# Altium schematic sheet MCU_LCD.SchDoc
size A4
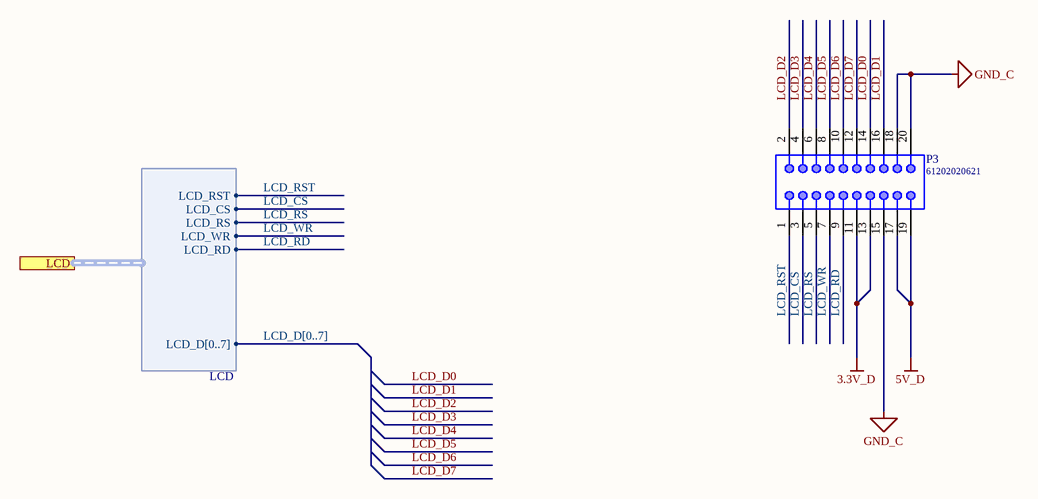
[diagram p0: MCU_LCD.SchDoc]

## Parts
P3  61202020621  [61202020621]

## Ports
LCD (harness LCD)

## Harnesses
LCD: LCD_CS, LCD_D[0..7], LCD_RD, LCD_RS, LCD_RST, LCD_WR

## Nets
3.3V_D: P3.11 P3.13
5V_D: P3.17 P3.19
GND_C: P3.15 P3.18 P3.20
LCD_CS: P3.3 ; port LCD.LCD_CS
LCD_D0: P3.14
LCD_D1: P3.16
LCD_D2: P3.2
LCD_D3: P3.4
LCD_D4: P3.6
LCD_D5: P3.8
LCD_D6: P3.10
LCD_D7: P3.12
LCD_RD: P3.9 ; port LCD.LCD_RD
LCD_RS: P3.5 ; port LCD.LCD_RS
LCD_RST: P3.1 ; port LCD.LCD_RST
LCD_WR: P3.7 ; port LCD.LCD_WR

## Buses and harness runs
bus LCD_D[0..7]

## Library data of the parts
P3 = 61202020621: Male Box Header WR-BHD, SMT, Vertical, pitch 2.54 mm, 20 pins; Pitch: 2.54 mm; Working Voltage: 250 VAC; Withstanding Voltage: 500 VAC; Contact Resistance: 20 mOhm; Pin Number: 20; ComponentLink1Description: Manufacturer; ComponentLink1URL: http://www.we-online.de; ComponentLink2Description: Datasheet; ComponentLink2URL: https://katalog.we-online.de/em/datasheet/6120xx20621.pdf; Part Number: 61202020621; Published Date: August 2018; Publisher: Wurth Elektronik; Operating Temperature: -40 to 125 degC; Packaging: Tube; Gender: Male; Mounting Technology: SMT; Orientation: Vertical